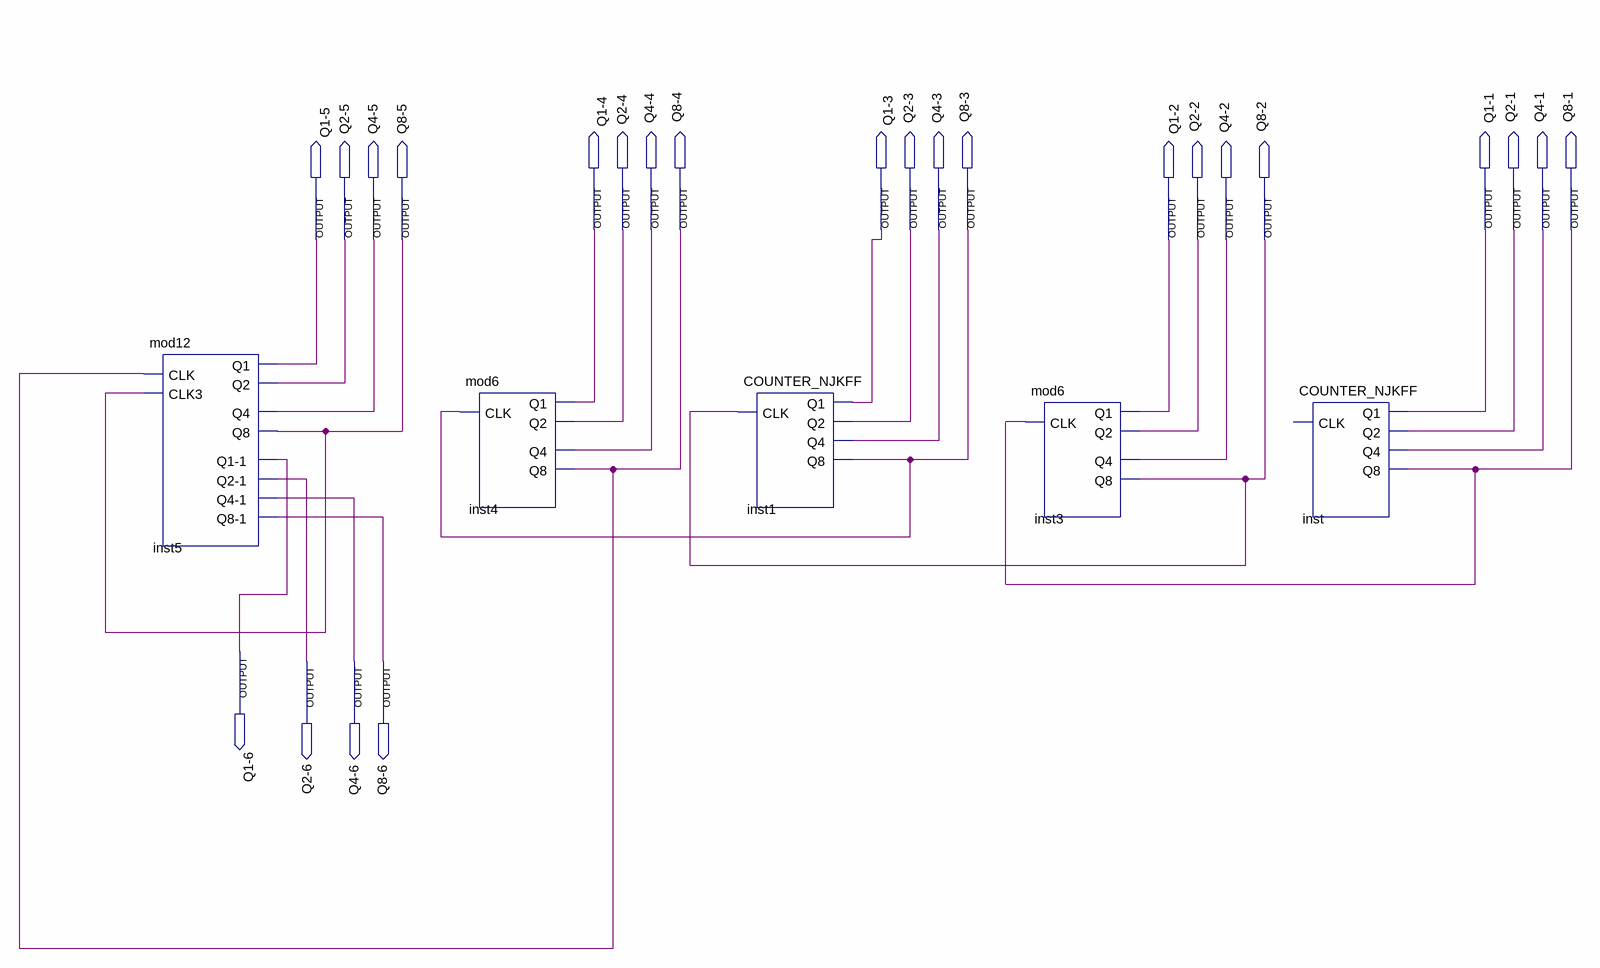
[diagram p0: schematic sheet]
// Quartus schematic twelveHR.bdf as structural Verilog: 5 symbols, 24 pins
module twelveHR (
  output \Q1-4 ,
  output \Q2-4 ,
  output \Q4-4 ,
  output \Q8-4 ,
  output \Q1-3 ,
  output \Q2-3 ,
  output \Q4-3 ,
  output \Q8-3 ,
  output \Q1-1 ,
  output \Q2-1 ,
  output \Q4-1 ,
  output \Q8-1 ,
  output \Q1-5 ,
  output \Q2-5 ,
  output \Q4-5 ,
  output \Q8-5 ,
  output \Q1-2 ,
  output \Q2-2 ,
  output \Q4-2 ,
  output \Q8-2 ,
  output \Q1-6 ,
  output \Q2-6 ,
  output \Q4-6 ,
  output \Q8-6 
);

  mod12 inst5 (
    .CLK(\Q8-4 ), .CLK3(\Q8-5 ), .Q2(\Q2-5 ), .Q8(\Q8-5 ), .Q1(\Q1-5 ), .Q4(\Q4-5 ), .\Q2-1 (\Q2-6 ),
    .\Q8-1 (\Q8-6 ), .\Q1-1 (\Q1-6 ), .\Q4-1 (\Q4-6 ));
  mod6 inst4 (.CLK(\Q8-3 ), .Q2(\Q2-4 ), .Q8(\Q8-4 ), .Q1(\Q1-4 ), .Q4(\Q4-4 ));
  COUNTER_NJKFF inst1 (.CLK(\Q8-2 ), .Q2(\Q2-3 ), .Q8(\Q8-3 ), .Q1(\Q1-3 ), .Q4(\Q4-3 ));
  mod6 inst3 (.CLK(\Q8-1 ), .Q2(\Q2-2 ), .Q8(\Q8-2 ), .Q1(\Q1-2 ), .Q4(\Q4-2 ));
  COUNTER_NJKFF inst (.Q2(\Q2-1 ), .Q8(\Q8-1 ), .Q1(\Q1-1 ), .Q4(\Q4-1 ));  // open: CLK
endmodule
